# EAGLE design 50x15 (EAGLE 9.5.2)
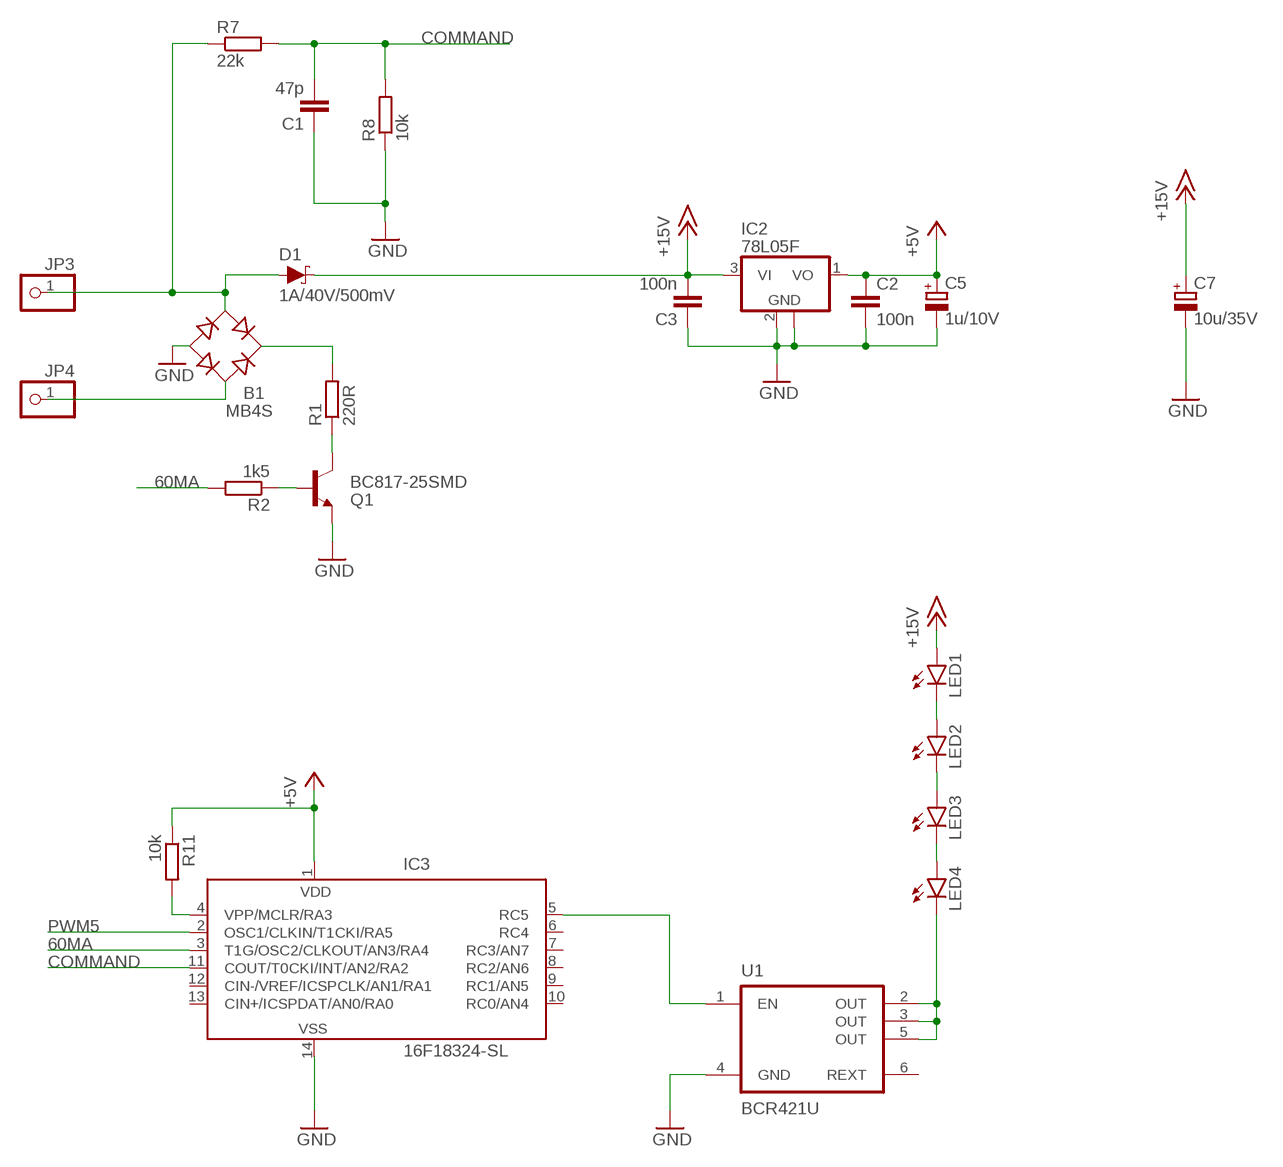
[diagram p0: schematic, sheet 1]

## Parts
B1  MB4S  [SOIC-4]
C1  47p  C-EUC0805  [C0805]
C2  100n  C-EUC3216  [C3216]
C3  100n  C-EUC3216  [C3216]
C5  1u/10V  CPOL-EUA/3216-18R  [A/3216-18R]
C7  10u/35V  CPOL-EUD/7343-31R  [D/7343-31R]
D1  1A/40V/500mV  DIODE-SCHOTTKY-SS14  [SMA-DIODE]
IC2  78L05F  [SOT89]
IC3  16F18324-SL  PIC16F676SL  [SO-14]
JP3  PINHD-1X1  [1X01]
JP4  PINHD-1X1  [1X01]
LED1  LEDKA-3528ASYC  [KA-3528ASYC]
LED2  LEDKA-3528ASYC  [KA-3528ASYC]
LED3  LEDKA-3528ASYC  [KA-3528ASYC]
LED4  LEDKA-3528ASYC  [KA-3528ASYC]
Q1  BC817-25SMD  [SOT23-BEC]
R1  220R  R-EU_R1206  [R1206]
R2  1k5  R-EU_R1206  [R1206]
R7  22k  R-EU_R1206  [R1206]
R8  10k  R-EU_R1206  [R1206]
R11  10k  R-EU_R1206  [R1206]
U1  BCR421U  [SC74-6]

## Nets
60MA: IC3.3(T1G/OSC2/CLKOUT/AN3/RA4) R2.2
+5V: C2.1 C5.+ IC2.1(VO) IC3.1(VDD) R11.1
+15V: C3.2 C7.+ D1.C IC2.3(VI) LED1.A
COMMAND: C1.2 IC3.11(COUT/T0CKI/INT/AN2/RA2) R7.2 R8.2
GND: B1.- C1.1 C2.2 C3.1 C5.- C7.- IC2.2(GND) IC2.2@1(GND) IC3.14(VSS) Q1.E R8.1 U1.4(GND)
N$1: B1.~2(AC2) JP4.1
N$2: B1.~1(AC1) D1.A JP3.1 R7.1
N$3: Q1.C R1.1
N$4: Q1.B R2.1
N$5: B1.+ R1.2
N$6: IC3.5(RC5) U1.1(EN)
N$8: LED4.C U1.2(OUT) U1.3(OUT) U1.5(OUT)
N$10: LED3.C LED4.A
N$20: LED2.C LED3.A
N$21: LED1.C LED2.A
N$28: IC3.4(VPP/MCLR/RA3) R11.2
PWM5: IC3.2(OSC1/CLKIN/T1CKI/RA5)
Unconnected: IC3.6(RC4) IC3.7(RC3/AN7) IC3.8(RC2/AN6) IC3.9(RC1/AN5) IC3.10(RC0/AN4) IC3.12(CIN-/VREF/ICSPCLK/AN1/RA1) IC3.13(CIN+/ICSPDAT/AN0/RA0) U1.6(REXT)

## Library data of the parts
B1 = rectifier:MB*S: Bridge Rectifier Source: http://www.fairchildsemi.com/ds/MB/MB6S.pdf
C1-C3 = rcl:C-EU: CAPACITOR, European symbol; SPICEPREFIX: C
C5 C7 = rcl:CPOL-EU: POLARIZED CAPACITOR, European symbol; SPICEPREFIX: C
D1 = SparkFun-DiscreteSemi:DIODE-SCHOTTKY: Schottky diode A Schottky diode is a semiconductor diode which has a low forward voltage drop and a very fast switching action.; PROD_ID: DIO-08053
IC2 = linear:78L*: POSITOIV-VOLTAGE REGULATORS Output up to 100 mA Source: Datasheet <http://focus.ti.com/lit/ds/symlink/ua78l05.pdf>
IC3 = microchip:PIC16F676: 14-Pin, Flash-Based 8-Bit CMOS Microcontroller High Performance RISC CPU: * Only 35 instructions to learn - All single-cycle instructions except branches * Operating speed: - DC - 20 MHz oscillator/clock input - DC - 200 ns instruction cycle * Internal and external oscillator options - Precision Internal 4 MHz oscillator factory calibrated to ±1% - External Oscillator support for crystals and resonators - 5?s wake-up from SLEEP, 3.0V, typical * Power saving SLEEP mode * Wide operating voltage range - 2.0V to 5.5V * Industrial and Extended temperature range * Low power Power-on Reset (POR) * Power-up Timer (PWRT) and Oscillator Start-up Timer (OST) * Brown-out Detect (BOD) * Watchdog Timer (WDT) with independent oscillator for reliable operation * Multiplexed MCLR/Input-pin * Interrupt-on-pin change * Individual programmable weak pull-ups * Programmable code protection * High Endurance FLASH/EEPROM Cell - 100,000 write FLASH endurance - 1,000,000 write EEPROM endurance - FLASH/Data EEPROM Retention: > 40 years * Standby Current: - 1 nA @ 2.0V, typical * Operating Current: - 8.5?A @ 32 kHz, 2.0V, typical - 100?A @ 1 MHz, 2.0V, typical * Watchdog Timer Current - 300 nA @ 2.0V, typical * Timer1 oscillator current: - 4?A @ 32 kHz, 2.0V, typical * 12 I/O pins with individual direction control * High current sink/source for direct LED drive * Analog-to-Digital Converter module (PIC16F676): - 10-bit resolution - Programmable 8-channel input - Voltage reference input * In-Circuit Serial ProgrammingTM (ICSPTM) via two pins Source: http://ww1.microchip.com/downloads/en/DeviceDoc/40039E.pdf; MF: MICROCHIP; MPN: PIC16F676-I/SL; OC_FARNELL: 9760520; OC_NEWARK: 92C4557
JP3 JP4 = pinhead:PINHD-1X1: PIN HEADER
LED1-LED4 = led:LED: LED OSRAM: - CHIPLED LG R971, LG N971, LY N971, LG Q971, LY Q971, LO R971, LY R971 LH N974, LH R974 LS Q976, LO Q976, LY Q976 LO Q996 - Hyper CHIPLED LW Q18S LB Q993, LB Q99A, LB R99A - SideLED LS A670, LO A670, LY A670, LG A670, LP A670 LB A673, LV A673, LT A673, LW A673 LH A674 LY A675 LS A676, LA A676, LO A676, LY A676, LW A676 LS A679, LY A679, LG A679 - Hyper Micro SIDELED® LS Y876, LA Y876, LO Y876, LY Y876 LT Y87S - SmartLED LW L88C, LW L88S LB L89C, LB L89S, LG L890 LS L89K, LO L89K, LY L89K LS L896, LA L896, LO L896, LY L896 - TOPLED LS T670, LO T670, LY T670, LG T670, LP T670 LSG T670, LSP T670, LSY T670, LOP T670, LYG T670 LG T671, LOG T671, LSG T671 LB T673, LV T673, LT T673, LW T673 LH T674 LS T676, LA T676, LO T676, LY T676, LB T676, LH T676, LSB T676, LW T676 LB T67C, LV T67C, LT T67C, LS T67K, LO T67K, LY T67K, LW E67C LS E67B, LA E67B, LO E67B, LY E67B, LB E67C, LV E67C, LT E67C LW T67C LS T679, LY T679, LG T679 LS T770, LO T770, LY T770, LG T770, LP T770 LB T773, LV T773, LT T773, LW T773 LH T774 LS E675, LA E675, LY E675, LS T675 LS T776, LA T776, LO T776, LY T776, LB T776 LHGB T686 LT T68C, LB T68C - Hyper Mini TOPLED® LB M676 - Mini TOPLED Santana® LG M470 LS M47K, LO M47K, LY M47K Source: http://www.osram.convergy.de LUXEON: - LUMILED® LXK2-PW12-R00, LXK2-PW12-S00, LXK2-PW14-U00, LXK2-PW14-V00 LXK2-PM12-R00, LXK2-PM12-S00, LXK2-PM14-U00 LXK2-PE12-Q00, LXK2-PE12-R00, LXK2-PE12-S00, LXK2-PE14-T00, LXK2-PE14-U00 LXK2-PB12-K00, LXK2-PB12-L00, LXK2-PB12-M00, LXK2-PB14-N00, LXK2-PB14-P00, LXK2-PB14-Q00 LXK2-PR12-L00, LXK2-PR12-M00, LXK2-PR14-Q00, LXK2-PR14-R00 LXK2-PD12-Q00, LXK2-PD12-R00, LXK2-PD12-S00 LXK2-PH12-R00, LXK2-PH12-S00 LXK2-PL12-P00, LXK2-PL12-Q00, LXK2-PL12-R00 Source: www.luxeon.com KINGBRIGHT: KA-3528ASYC Source: www.kingbright.com
Q1 = transistor-npn:BC817*: NPN Transistor
R1 R2 R7 R8 R11 = rcl:R-EU_: RESISTOR, European symbol; SPICEPREFIX: R
U1 = BCR421U:BCR421U: LED DRIVER; AVAILABILITY: Unavailable; DESCRIPTION: LED Driver IC 1 Output Linear PWM Dimming 350mA SOT-26; MF: Infineon; MP: BCR421U; PACKAGE: SC-74 Infineon; PRICE: None

## Board
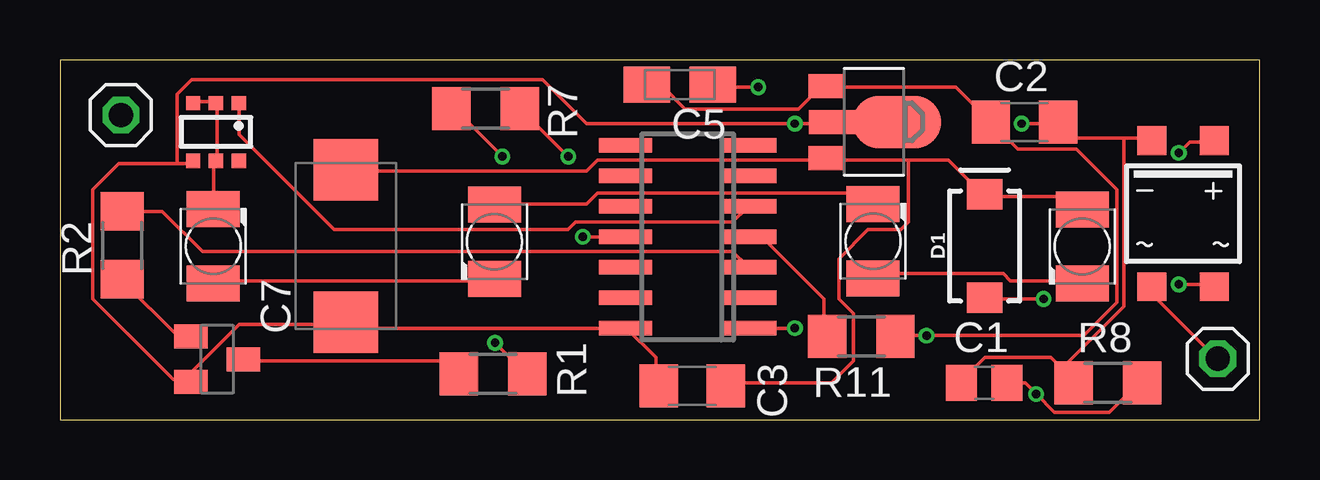
[diagram p1: board, top side]
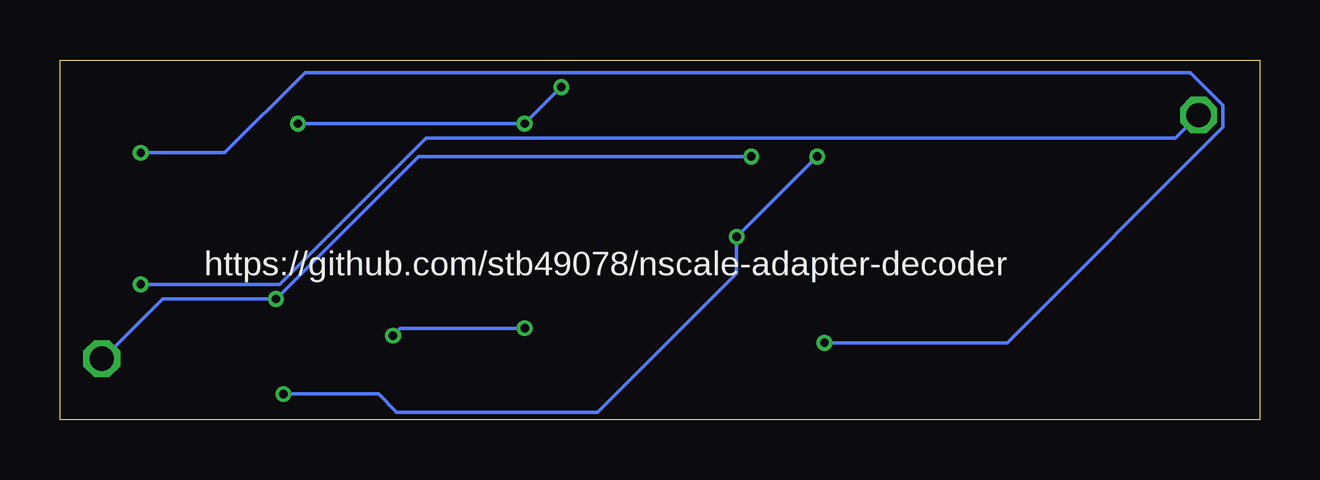
[diagram p2: board, bottom side, seen from below]

Size 50 x 15 mm. Coordinates in mm from the lower left corner, seen from the top.
Outline: 0,0 50,0 50,15 0,15 0,0
Copper layers (1*16): Top 0.035mm / dielectric 1.5mm / Bottom 0.035mm
Design rules "default *": minimum track width 6mil, minimum drill 0.35mm, track to track 6mil, track to pad 6mil, pad to pad 6mil, via to via 6mil, smd to smd 6mil, copper to edge 6mil, drill to drill 6mil, minimum pad ring 6mil, minimum via ring 6mil, stop-mask expansion 4mil, vias tented up to drill 0mil, thermal gap 10mil

### Footprints (pad centres in the part's own frame; a part is rotated, then mirrored left to right if it is on the bottom)
SOIC-4 = smd 1.2 x 1.2: + 1.3,3.05; - -1.3,3.05; ~1 -1.3,-3.05; ~2 1.3,-3.05
C0805 = smd 1.3 x 1.5: 1 -0.95,0; 2 0.95,0
C3216 = smd 1.6 x 1.8: 1 -1.4,0; 2 1.4,0
A/3216-18R = smd 1.95 x 1.5: + 1.375,0; - -1.375,0
D/7343-31R = smd 2.55 x 2.7: + 3.175,0; - -3.175,0
SMA-DIODE = smd 1.27 x 1.47: A -2.15,0; C 2.15,0
SOT89 = smd 1 x 1.5: 1 -1.499,-1.981; 3 1.499,-1.981 | smd 1 x 2: 2 0,-1.727 | smd 2.2 x 3.7: 2@1 0,0.94
SO-14 = smd 0.6 x 2.2: 1 -3.81,-2.6; 2 -2.54,-2.6; 3 -1.27,-2.6; 4 0,-2.6; 5 1.27,-2.6; 6 2.54,-2.6; 7 3.81,-2.6; 8 3.81,2.6; 9 2.54,2.6; 10 1.27,2.6; 11 0,2.6; 12 -1.27,2.6; 13 -2.54,2.6; 14 -3.81,2.6
1X01 = drill 1.016 octagon: 1 0,0
KA-3528ASYC = smd 1.5 x 2.2: A -1.55,0; C 1.55,0
SOT23-BEC = smd 1 x 1.4: B -0.95,-1.1; C 0,1.1; E 0.95,-1.1
R1206 = smd 1.6 x 1.803: 1 -1.422,0; 2 1.422,0
SC74-6 = smd 0.6 x 0.6: 1 -0.95,-1.2; 2 0,-1.2; 3 0.95,-1.2; 4 0.95,1.2; 5 0,1.2; 6 -0.95,1.2

### Placement (x,y rotation side)
B1  46.81,8.59 0 top
C1  38.52,1.53 0 top
C2  40.2,12.41 0 top
C3  26.35,1.41 0 top
C5  25.83,13.97 180 top
C7  11.92,7.24 90 top
D1  38.54,7.24 90 top
IC2  33.94,12.41 270 top
IC3  26.17,7.62 90 top
JP3  48.26,2.54 0 top
JP4  2.54,12.7 0 top
LED1  42.61,7.22 270 top
LED2  33.89,7.43 90 top
LED3  18.11,7.42 270 top
LED4  6.39,7.23 90 top
Q1  6.55,2.52 270 top
R1  18.05,1.91 0 top
R2  2.59,7.27 90 top
R7  17.74,12.97 180 top
R8  43.68,1.53 0 top
R11  33.4,3.47 180 top
U1  6.5,12 180 top

### Tracks (layer width: path | path; a pad name or v marks a point on that pad's centre or on a via)
60MA
  Top 0.152: R2.2 4.27,8.69 5.94,7.01 28.04,7.01 28.65,6.4 IC3.3
+5V  (via drill 0.35)
  Top 0.152: R11.1 34.9,3.5 v36.12,3.5 42.67,3.5 44.04,4.88 44.04,9.6 42.37,11.28 39.93,11.28 38.86,12.34 C2.1 38.71,12.5 37.34,13.87 32,13.87 IC2.1 31.85,14.02 30.79,12.95 26.06,12.95 25.15,13.87 24.54,13.87 C5.+ | v30.63,3.81 IC3.1
  Bottom 0.152: v30.63,3.81 35.81,3.81 v36.12,3.5
+15V
  Top 0.152: LED1.A 42.52,8.84 42.06,9.3 38.56,9.3 D1.C 38.41,9.45 37.03,10.82 35.36,10.82 | 35.36,10.82 32,10.82 IC2.3 31.85,10.82 22.4,10.82 21.95,10.36 12.04,10.36 C7.+ | 35.36,10.82 35.36,8.23 35.05,7.92 33.68,7.92 32.46,6.71 32.46,5.03 33.07,4.42 33.07,2.44 32.16,1.52 27.89,1.52 C3.2
COMMAND  (via drill 0.35)
  Top 0.152: C1.2 40.23,1.52 v40.69,1.07 41.45,0.3 43.74,0.3 44.96,1.52 R8.2 | v18.44,10.97 16.46,12.95 R7.2 | IC3.11 v21.79,7.62
  Bottom 0.152: v18.44,10.97 v21.79,7.62 21.79,6.1 27.58,0.3 35.97,0.3 36.73,1.07 v40.69,1.07
GND  (via drill 0.35)
  Top 0.152: 44.35,11.73 42.22,11.73 41.6,12.34 C2.2 41.45,12.34 v40.08,12.34 | 44.35,11.73 45.41,11.73 B1.- | 41.76,2.13 42.22,1.68 R8.1 41.76,2.13 | 41.76,2.13 41.3,2.59 38.56,2.59 37.64,1.68 C1.1 | 44.35,11.73 44.35,4.72 41.76,2.13 | v29.11,13.87 27.28,13.87 C5.- | IC2.2@1 34.75,12.5 32.31,12.5 IC2.2 32.16,12.34 v30.63,12.34 21.95,12.34 20.12,14.17 5.49,14.17 4.88,13.56 4.88,10.67 | C3.1 24.84,1.52 24.84,2.59 23.62,3.81 IC3.14 12.19,3.81 12.04,3.96 C7.- 11.89,3.96 7.47,3.96 5.18,1.68 | 4.88,10.67 2.44,10.67 1.37,9.6 1.37,5.03 4.72,1.68 5.18,1.68 | 4.88,10.67 5.49,10.67 U1.4 | 5.18,1.68 5.33,1.68 Q1.E 5.18,1.68
  Bottom 0.152: v29.11,13.87 v30.63,12.34 v40.08,12.34
N$1  (via drill 0.35)
  Top 0.152: v46.63,5.64 48.01,5.64 B1.~2
  Bottom 0.152: v46.63,5.64 40.84,5.64 34.75,11.73 3.5,11.73 JP4.1
N$2  (via drill 0.35)
  Top 0.152: B1.~1 45.57,5.49 45.57,5.18 48.16,2.59 JP3.1 | v41,5.03 38.56,5.03 D1.A | v21.18,10.97 19.2,12.95 R7.1
  Bottom 0.152: JP3.1 48.16,2.59 45.72,5.03 v41,5.03 35.05,10.97 v21.18,10.97
N$3
  Top 0.152: Q1.C 7.77,2.44 16.15,2.44 16.61,1.98 R1.1
N$4
  Top 0.152: Q1.B 5.33,3.5 4.88,3.5 2.59,5.79 R2.1
N$5  (via drill 0.35)
  Top 0.152: v46.63,11.12 47.09,11.58 48.01,11.58 B1.+ | v18.14,3.2 19.36,1.98 R1.2
  Bottom 0.152: v46.63,11.12 43.13,11.12 39.78,14.48 2.9,14.48 1.52,13.11 1.52,12.19 10.52,3.2 v18.14,3.2
N$6
  Top 0.152: U1.1 7.47,13.11 7.47,11.89 11.43,7.92 21.18,7.92 21.49,8.23 28.04,8.23 28.65,8.84 IC3.5
N$8
  Top 0.152: U1.3 5.64,13.26 6.4,13.26 U1.2 6.55,13.11 6.55,10.82 U1.5 6.4,10.67 6.4,8.84 LED4.C
N$10
  Top 0.152: LED4.A 6.4,5.79 17.98,5.79 LED3.C
N$20
  Top 0.152: LED3.A 18.14,8.99 21.95,8.99 22.4,9.45 33.38,9.45 33.83,8.99 LED2.C
N$21
  Top 0.152: LED1.C 42.52,5.79 39.62,5.79 39.32,6.1 34.14,6.1 33.98,5.94 LED2.A
N$28
  Top 0.152: IC3.4 29.26,7.62 31.85,5.03 31.85,3.5 R11.2

### Text on the board
bNames: https://github.com/stb49078/nscale-adapter-decoder